# Altium schematic sheet Power Supply.SchDoc
size A4
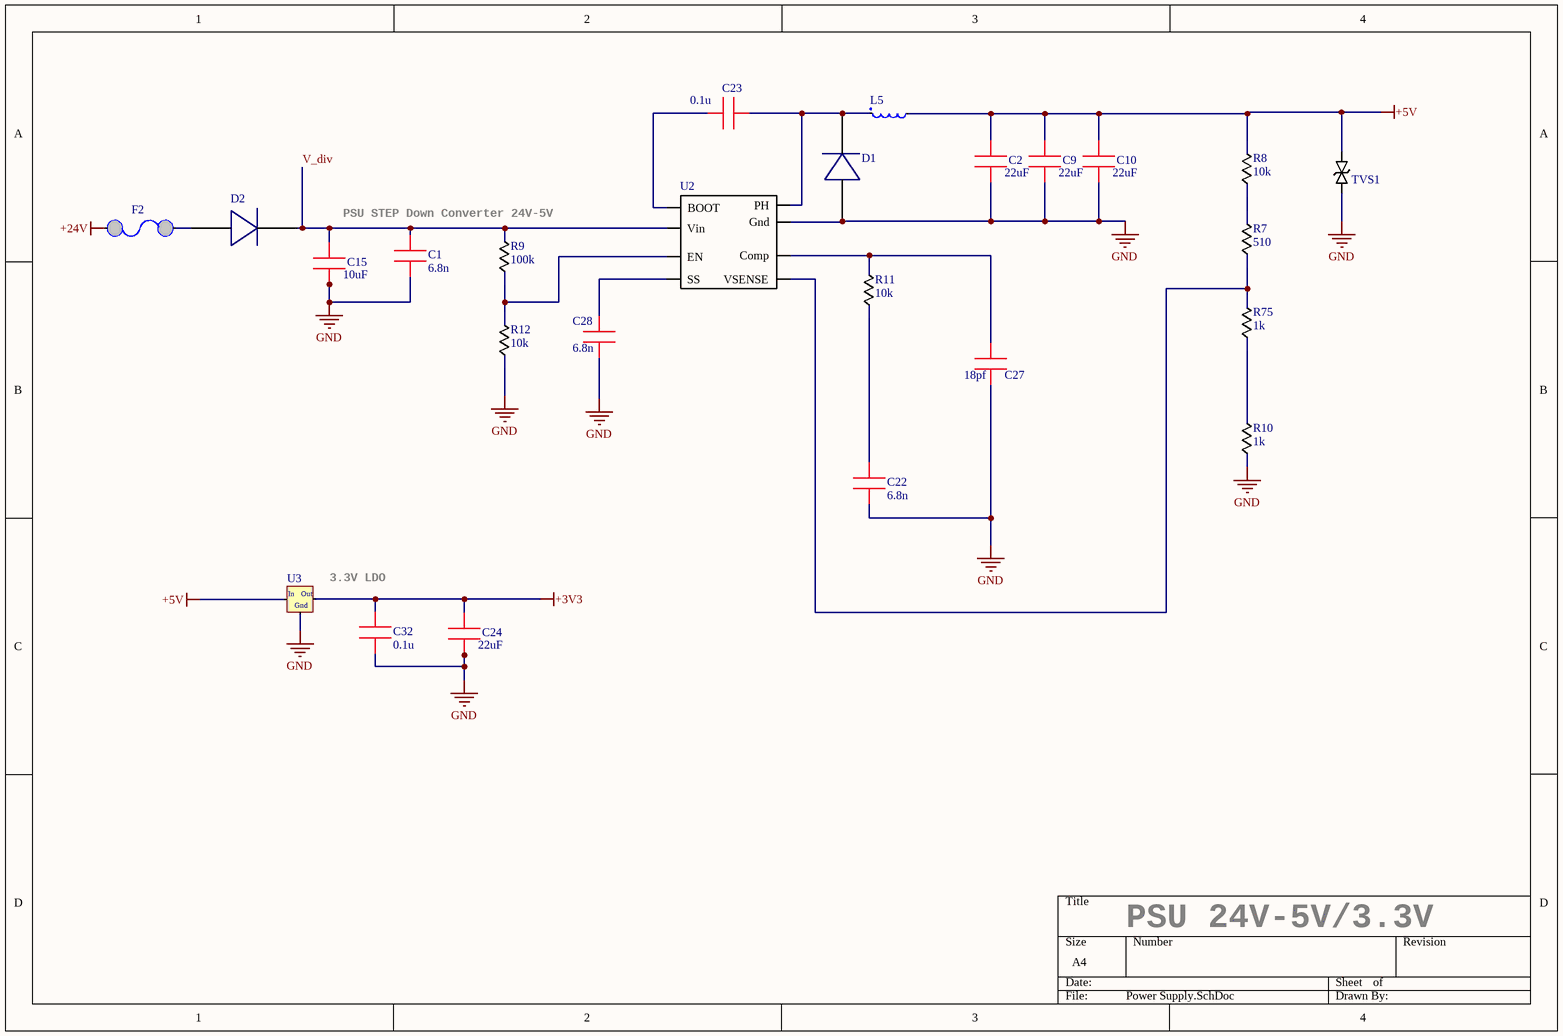
[diagram p0: Power Supply.SchDoc]

## Parts
C1  6.8n  [0603]
C2  22uF  [1206]
C9  22uF  [1206]
C10  22uF  [1206]
C15  10uF  [1206]
C22  6.8n  [0603]
C23  0.1u  [0603]
C24  22uF  [1206]
C27  18pf  [0603]
C28  6.8n  [0603]
C32  0.1u  [0603]
D1  (no value)  [B340A-13-F]
D2  (no value)  [B340A-13-F]
F2  (no value)  [Fuse PTS]
L5  (no value)  [CDRH127/LDNP-270MC,]
R7  510  [0603]
R8  10k  [0603]
R9  100k  [0603]
R10  1k  [0603]
R11  10k  [0603]
R12  10k  [0603]
R75  1k  [0603]
TVS1  (no value)  [DO-214AC]
U2  (no value)  [SOIC 8]
U3  (no value)  [SOT223]

## Nets
+3V3: C24.2 C32.1 U3.2(OUT)
+5V: C2.2 C9.2 C10.2 L5.2 R8.2 TVS1.2 U3.3(IN)
+24V: F2.2
GND: C1.1 C2.1 C9.1 C10.1 C15.1 C22.1 C24.1 C27.1 C28.1 C32.2 D1.2 R10.1 R12.1 TVS1.1 U2.7(Gnd) U3.1(GND)
V_div: C1.2 C15.2 D2.1 R9.2 U2.2(Vin)
NetC22_2: C22.2 R11.1
NetC23_1: C23.1 U2.1(BOOT)
NetC23_2: C23.2 D1.1 L5.1 U2.8(PH)
NetC27_2: C27.2 R11.2 U2.6(Comp)
NetC28_2: C28.2 U2.4(SS)
NetD2_2: D2.2 F2.1
NetR7_1: R7.1 R75.2 U2.5(VSENSE)
NetR7_2: R7.2 R8.1
NetR9_1: R9.1 R12.2 U2.3(EN)
NetR10_2: R10.2 R75.1

## Notes on the sheet
- PSU STEP Down Converter 24V-5V
- (near U3) 3.3V LDO
- PSU 24V-5V/3.3V
- (in symbol NCV1117ST50T3G) In; Out; Gnd

## Library data of the parts
C1 C22 = 0603 CAP: Part Description: 50V 6800pF X7R 0603 10%; Part Number: CC0603KRX7R9BB682
C2 C9 C10 C24 = 0805 Cap: Part Description: 16V 22uF X5R 1206; Part Number: CC1206KKX5R7BB226
C15 = 0805 Cap: Part Description: 10UF 50V 10% 1206; Part Number: GRM31CR61H106KA12L
C23 = 0805 Cap: Part Description: 0.1 uF 100 VDC 10% 0603 X7R; Part Number: GRM188R72A104KA35D
C27 = 0805 Cap: Part Description: 18 pF 50 VDC 5% 0603 C0G; Part Number: GRM1885C1H180JA01D
C28 = 0805 Cap: Part Description: 50V 6800pF X7R 0603 10%; Part Number: CC0603KRX7R9BB682
C32 = Capasitor 0805: Part Description: 0.1 uF 100 VDC 10% 0603 X7R; Part Number: GRM188R72A104KA35D
D1 D2 = B340A-13-F: Part Description: Schottky Diodes & Rectifiers 60V 3A; Part Number: B360A-13-F
F2 = Fuse PTS: Part Description: PPTC 30V 300MA; Part Number: MF-MSMF030-2
L5 = CDRH127/LDNP-270MC: Part Description: Power Inductors - SMD 22uH 4.7A; Part Number: CDRH127/LDNP-220MC
R7 = Resistor 0805: Part Description: Resistor 0603, 510Ohms, 5%, 1/10W; Part Number: RC0603JR-07510RL
R8 R11 R12 = Resistor 0805: Part Description: Resistor 0603, 10kOhms, 5%, 1/10W; Part Number: RC0603JR-0710K
R9 = 0603 RES: Part Description: Resistor 0603, 100kOhms, 1%, 1/10W; Part Number: RC0603FR-07100KL
R10 R75 = Resistor 0805: Part Description: Resistor 0603, 1kOhms, 5%, 1/10W; Part Number: RC0603JR-071KL
TVS1 = TVS: Part Number: SMAJ5.0CA; Part Description: ESD Protection Diodes 5V
U2 = TPS54331: Part Description: Switching Voltage Regulators 3A 28V In Step Down; Part Number: TPS54331DR
U3 = NCV1117ST50T3G: Part Description: LDO Voltage Regulators 800MA 3.3V; Part Number: LM1117MPX-3.3